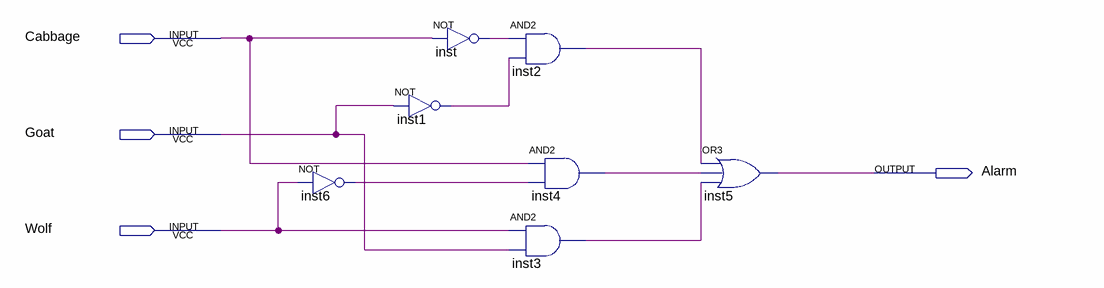
[diagram p0: schematic sheet]
// Quartus schematic lab2step2.bdf as structural Verilog: 7 symbols, 4 pins
module lab2step2 (
  input  Cabbage,
  input  Goat,
  input  Wolf,
  output Alarm
);

  wire inst1_out, inst2_out, inst3_out, inst4_out, inst6_out, inst_out;

  not inst6 (inst6_out, Wolf);
  not inst (inst_out, Cabbage);
  not inst1 (inst1_out, Goat);
  and inst2 (inst2_out, inst_out, inst1_out);
  and inst4 (inst4_out, Cabbage, inst6_out);
  and inst3 (inst3_out, Wolf, Goat);
  or inst5 (Alarm, inst2_out, inst4_out, inst3_out);
endmodule
